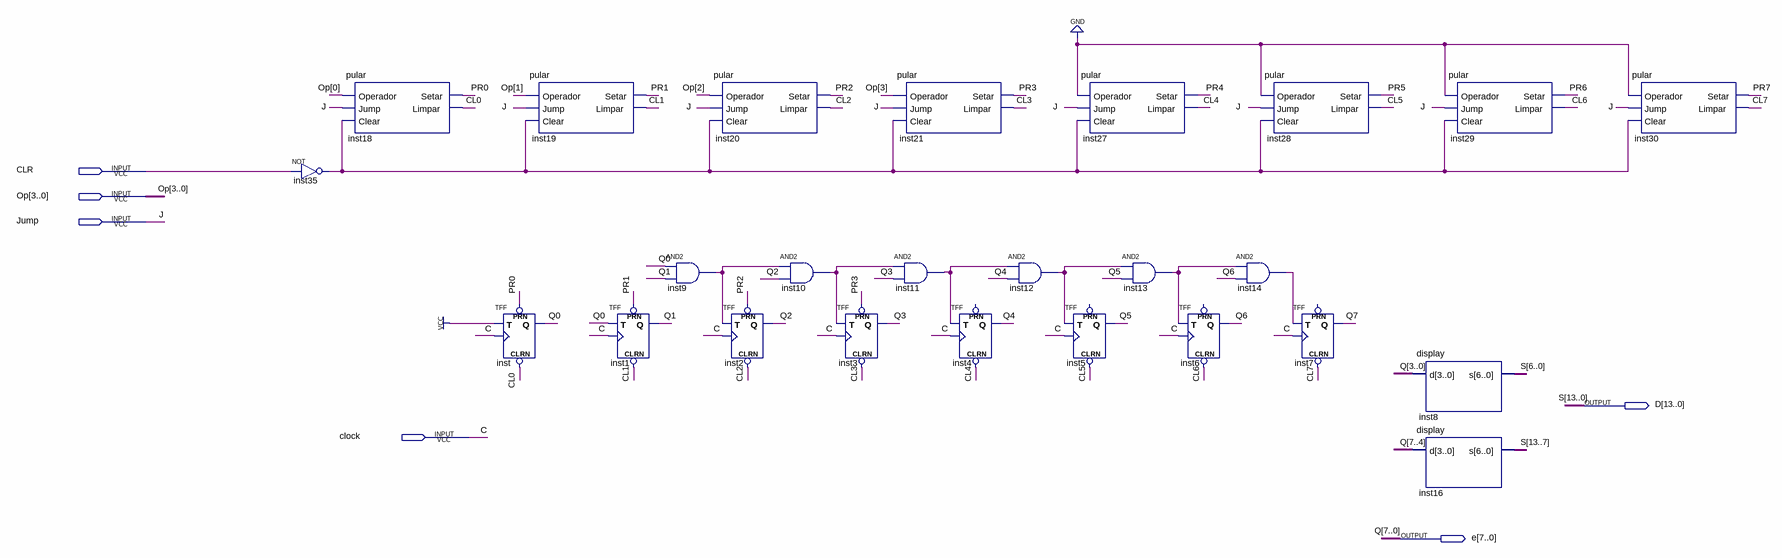
[diagram p0: schematic sheet]
// Quartus schematic contador.bdf as structural Verilog: 25 symbols, 6 pins
module contador (
  input  CLR,
  input  [3:0] Op,
  input  Jump,
  input  clock,
  output [13:0] D,
  output [7:0] e
);

  wire CL0, CL1, CL2, CL3, CL4, CL5, CL6, CL7, inst9_out, inst10_out, inst11_out, inst12_out, inst13_out,
       inst14_out, inst35_out, PR0, PR1, PR2, PR3, PR4, PR5, PR6, PR7;

  not inst35 (inst35_out, CLR);
  pular inst18 (.Operador(Op[0]), .Jump(Jump), .Clear(inst35_out), .Setar(PR0), .Limpar(CL0));
  TFF inst (.PRN(PR0), .CLRN(CL0), .T(1'b1), .CLK(clock), .Q(e[0]));
  pular inst19 (.Operador(Op[1]), .Jump(Jump), .Clear(inst35_out), .Setar(PR1), .Limpar(CL1));
  TFF inst1 (.PRN(PR1), .CLRN(CL1), .T(e[0]), .CLK(clock), .Q(e[1]));
  and inst9 (inst9_out, e[0], e[1]);
  pular inst20 (.Operador(Op[2]), .Jump(Jump), .Clear(inst35_out), .Setar(PR2), .Limpar(CL2));
  TFF inst2 (.PRN(PR2), .CLRN(CL2), .T(inst9_out), .CLK(clock), .Q(e[2]));
  and inst10 (inst10_out, inst9_out, e[2]);
  TFF inst3 (.PRN(PR3), .CLRN(CL3), .T(inst10_out), .CLK(clock), .Q(e[3]));
  pular inst21 (.Operador(Op[3]), .Jump(Jump), .Clear(inst35_out), .Setar(PR3), .Limpar(CL3));
  and inst11 (inst11_out, inst10_out, e[3]);
  TFF inst4 (.CLRN(CL4), .T(inst11_out), .CLK(clock), .Q(e[4]));  // open: PRN
  and inst12 (inst12_out, inst11_out, e[4]);
  TFF inst5 (.CLRN(CL5), .T(inst12_out), .CLK(clock), .Q(e[5]));  // open: PRN
  pular inst27 (.Operador(1'b0), .Jump(Jump), .Clear(inst35_out), .Setar(PR4), .Limpar(CL4));
  and inst13 (inst13_out, inst12_out, e[5]);
  TFF inst6 (.CLRN(CL6), .T(inst13_out), .CLK(clock), .Q(e[6]));  // open: PRN
  pular inst28 (.Operador(1'b0), .Jump(Jump), .Clear(inst35_out), .Setar(PR5), .Limpar(CL5));
  and inst14 (inst14_out, inst13_out, e[6]);
  TFF inst7 (.CLRN(CL7), .T(inst14_out), .CLK(clock), .Q(e[7]));  // open: PRN
  display inst8 (.d(e[3:0]), .s(D[6:0]));
  display inst16 (.d(e[7:4]), .s(D[13:7]));
  pular inst29 (.Operador(1'b0), .Jump(Jump), .Clear(inst35_out), .Setar(PR6), .Limpar(CL6));
  pular inst30 (.Operador(1'b0), .Jump(Jump), .Clear(inst35_out), .Setar(PR7), .Limpar(CL7));

  // Other names for the same wires on the sheet: C = clock; J = Jump; Q[7:0] = e; Q0 = e[0]; Q1 = e[1]; Q2 = e[2];
  //   Q3 = e[3]; Q4 = e[4]; Q5 = e[5]; Q6 = e[6]; Q7 = e[7]; S[13:0] = D
endmodule
